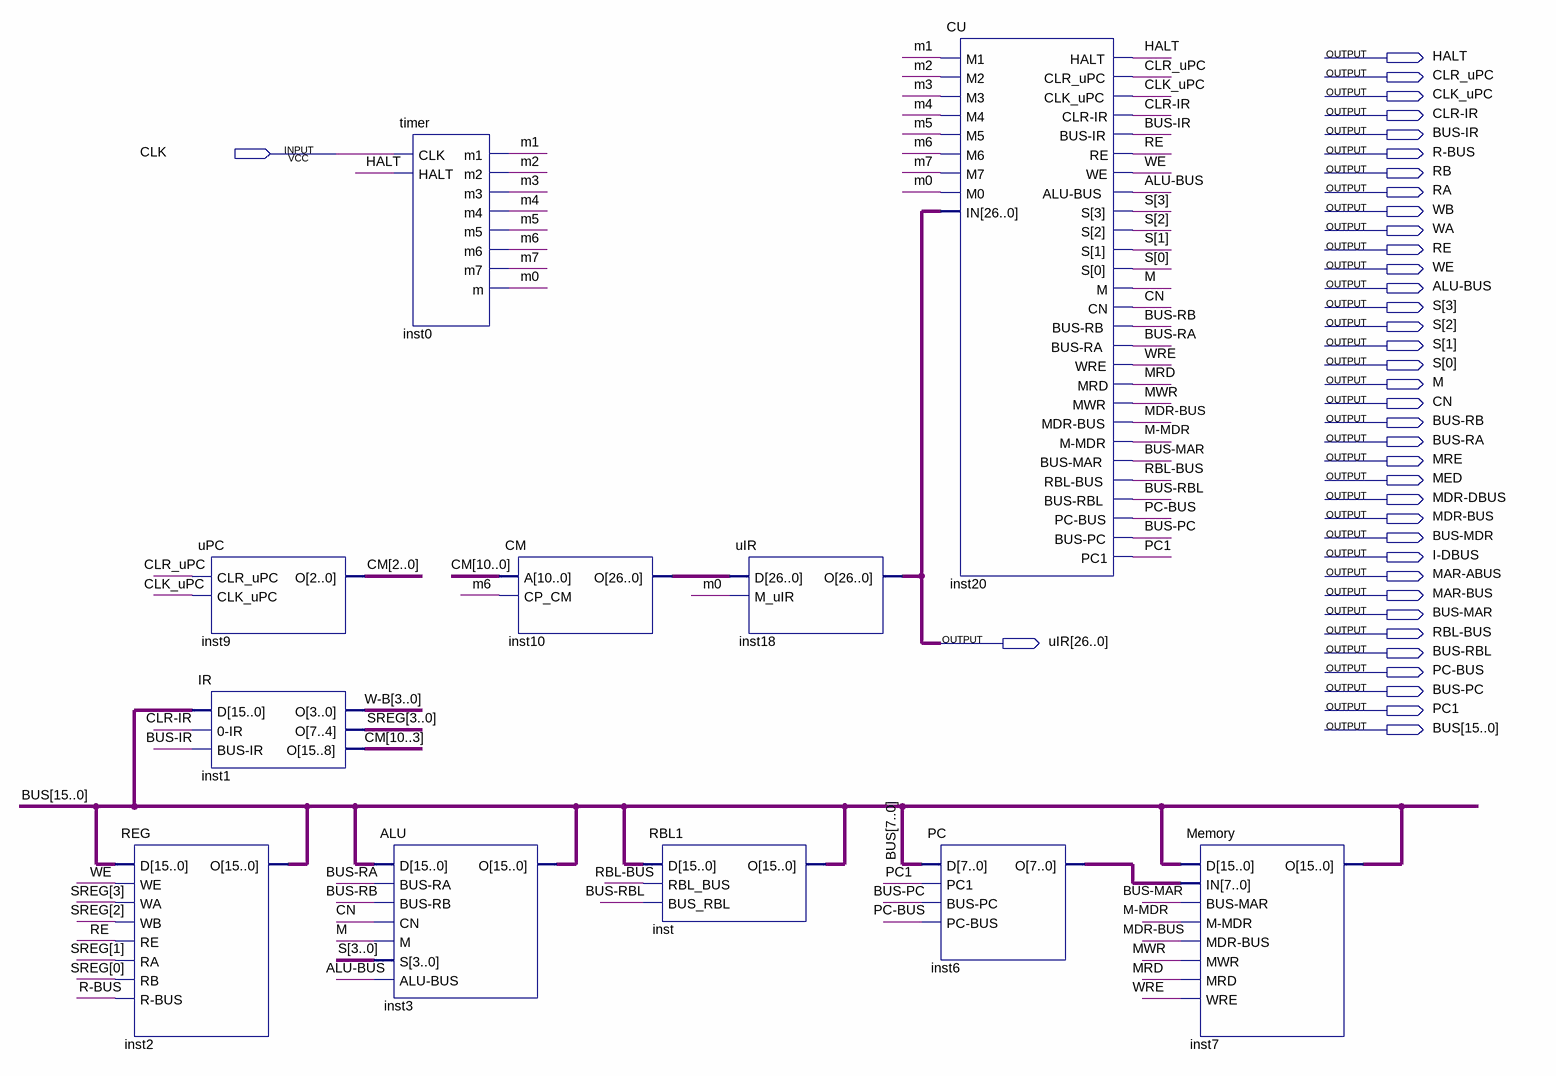
[diagram p0: schematic sheet]
// Quartus schematic CPU.bdf as structural Verilog: 11 symbols, 38 pins
module CPU (
  input  CLK,
  output HALT,
  output CLR_uPC,
  output CLK_uPC,
  output \CLR-IR ,
  output \BUS-IR ,
  output \R-BUS ,
  output RB,
  output RA,
  output WB,
  output WA,
  output RE,
  output WE,
  output \ALU-BUS ,
  output [3:0] S,
  output M,
  output CN,
  output \BUS-RB ,
  output \BUS-RA ,
  output MRE,
  output MED,
  output \MDR-DBUS ,
  output \MDR-BUS ,
  output \BUS-MDR ,
  output \I-DBUS ,
  output \MAR-ABUS ,
  output \MAR-BUS ,
  output \BUS-MAR ,
  output \RBL-BUS ,
  output [26:0] uIR,
  output \BUS-RBL ,
  output \PC-BUS ,
  output \BUS-PC ,
  output PC1,
  output [15:0] BUS
);

  wire m0, m1, m2, m3, m4, m5, m6, m7, \M-MDR , MRD, MWR, WRE;
  wire [3:0] SREG, \W-B ;
  wire [7:0] inst6_o;
  wire [10:0] CM;
  wire [26:0] inst10_o;

  REG inst2 (
    .D(BUS), .WE(WE), .WA(SREG[3]), .WB(SREG[2]), .RE(RE), .RA(SREG[1]), .RB(SREG[0]), .\R-BUS (\R-BUS ),
    .O(BUS));
  uPC inst9 (.CLR_uPC(CLR_uPC), .CLK_uPC(CLK_uPC), .O(CM[2:0]));
  IR inst1 (.D(BUS), .\0-IR (\CLR-IR ), .\BUS-IR (\BUS-IR ), .O({CM[10:3], SREG, \W-B }));
  timer inst0 (.CLK(CLK), .HALT(HALT), .m1(m1), .m2(m2), .m3(m3), .m4(m4), .m5(m5), .m6(m6), .m7(m7), .m(m0));
  ALU inst3 (.D(BUS), .\BUS-RA (\BUS-RA ), .\BUS-RB (\BUS-RB ), .CN(CN), .M(M), .S(S), .\ALU-BUS (\ALU-BUS ), .O(BUS));
  CM inst10 (.A(CM), .CP_CM(m6), .O(inst10_o));
  RBL1 inst (.D(BUS), .RBL_BUS(\RBL-BUS ), .BUS_RBL(\BUS-RBL ), .O(BUS));
  uIR inst18 (.D(inst10_o), .M_uIR(m0), .O(uIR));
  CU inst20 (
    .M1(m1), .M2(m2), .M3(m3), .M4(m4), .M5(m5), .M6(m6), .M7(m7), .M0(m0), .IN(uIR), .HALT(HALT),
    .CLR_uPC(CLR_uPC), .CLK_uPC(CLK_uPC), .\CLR-IR (\CLR-IR ), .\BUS-IR (\BUS-IR ), .RE(RE), .WE(WE),
    .\ALU-BUS (\ALU-BUS ), .S(S), .M(M), .CN(CN), .\BUS-RB (\BUS-RB ), .\BUS-RA (\BUS-RA ), .WRE(WRE),
    .MRD(MRD), .MWR(MWR), .\MDR-BUS (\MDR-BUS ), .\M-MDR (\M-MDR ), .\BUS-MAR (\BUS-MAR ),
    .\RBL-BUS (\RBL-BUS ), .\BUS-RBL (\BUS-RBL ), .\PC-BUS (\PC-BUS ), .\BUS-PC (\BUS-PC ), .PC1(PC1));
  PC inst6 (.D(BUS[7:0]), .PC1(PC1), .\BUS-PC (\BUS-PC ), .\PC-BUS (\PC-BUS ), .O(inst6_o));
  Memory inst7 (
    .D(BUS), .IN(inst6_o), .\BUS-MAR (\BUS-MAR ), .\M-MDR (\M-MDR ), .\MDR-BUS (\MDR-BUS ), .MWR(MWR),
    .MRD(MRD), .WRE(WRE), .O(BUS));
endmodule
